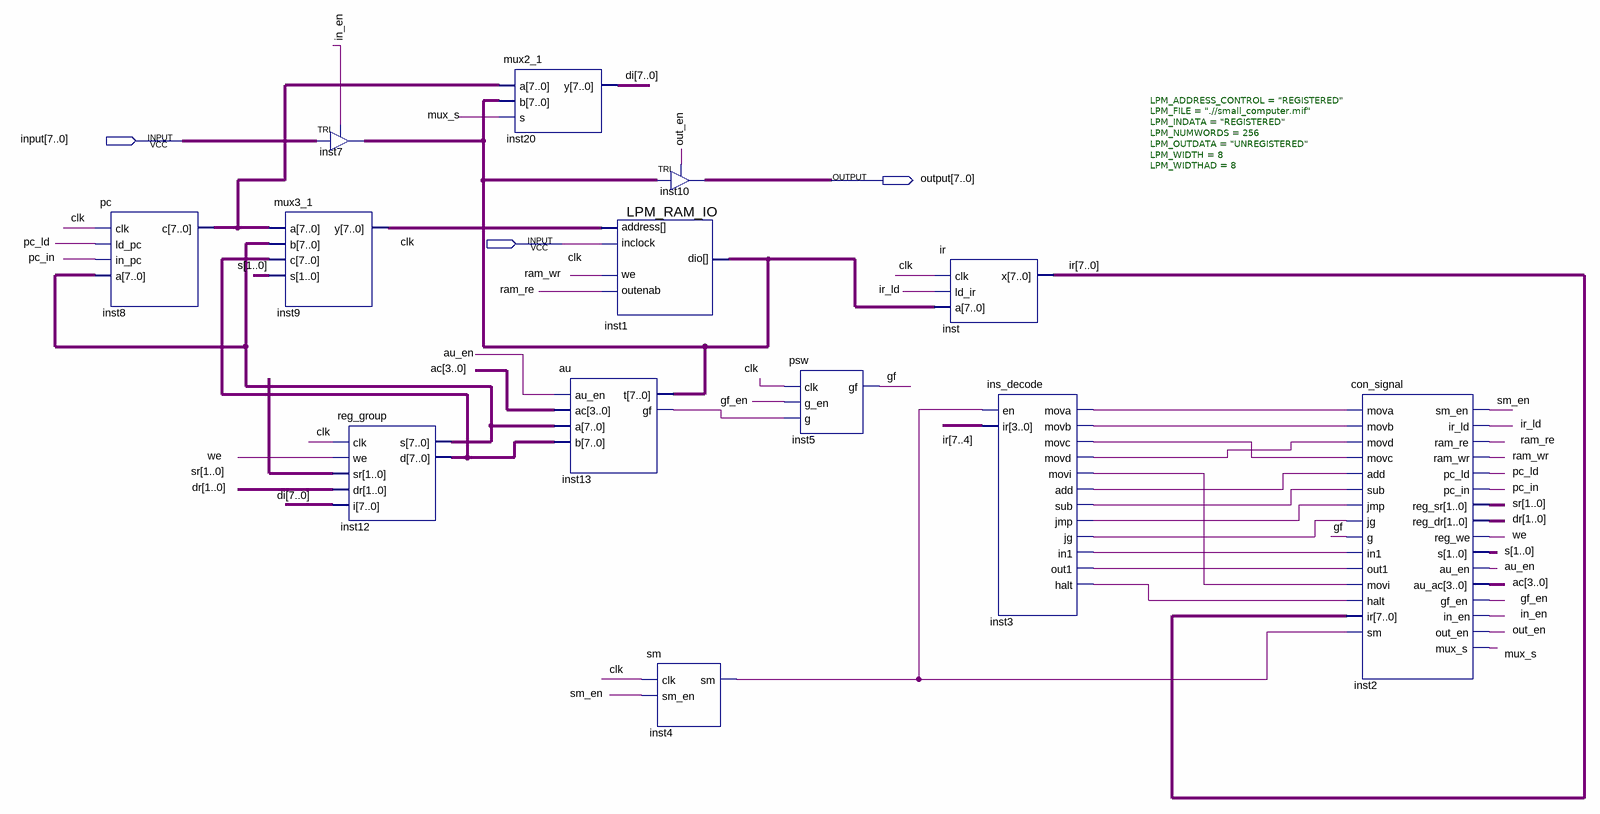
[diagram p0: schematic sheet]
// Quartus schematic small_computer.bdf as structural Verilog: 13 symbols, 3 pins
module small_computer (
  input  [7:0] \input ,
  input  clk,
  output [7:0] \output 
);

  wire au_en, gf, gf_en, in_en, inst3_add, inst3_halt, inst3_in1, inst3_jg, inst3_jmp, inst3_mova,
       inst3_movb, inst3_movc, inst3_movd, inst3_movi, inst3_out1, inst3_sub, inst4_sm, inst13_gf, ir_ld,
       mux_s, out_en, pc_in, pc_ld, ram_re, ram_wr, sm_en, we;
  wire [1:0] dr, s, sr;
  wire [3:0] ac;
  wire [7:0] di, inst7_out, inst8_c, inst9_y, inst12_d, inst12_s, ir;

  pc inst8 (.clk(clk), .ld_pc(pc_ld), .in_pc(pc_in), .a(inst12_s), .c(inst8_c));
  mux3_1 inst9 (.a(inst8_c), .b(inst12_s), .c(inst12_d), .s(s), .y(inst9_y));
  TRI inst7[7:0] (.IN(\input ), .OE(in_en), .OUT(inst7_out));
  reg_group inst12 (.clk(clk), .we(we), .sr(sr), .dr(dr), .i(di), .s(inst12_s), .d(inst12_d));
  mux2_1 inst20 (.a(inst8_c), .b(inst7_out), .s(mux_s), .y(di));
  LPM_RAM_IO #(.LPM_ADDRESS_CONTROL("REGISTERED"), .LPM_FILE(".//small_computer.mif"), .LPM_INDATA("REGISTERED"), .LPM_NUMWORDS(256), .LPM_OUTDATA("UNREGISTERED"), .LPM_WIDTH(8), .LPM_WIDTHAD(8)) inst1 (
    .address(inst9_y), .inclock(clk), .we(ram_wr), .outenab(ram_re), .dio(inst7_out));
  au inst13 (.au_en(au_en), .ac(ac), .a(inst12_s), .b(inst12_d), .t(inst7_out), .gf(inst13_gf));
  TRI inst10[7:0] (.IN(inst7_out), .OE(out_en), .OUT(\output ));
  sm inst4 (.clk(clk), .sm_en(sm_en), .sm(inst4_sm));
  psw inst5 (.clk(clk), .g_en(gf_en), .g(inst13_gf), .gf(gf));
  ir inst (.clk(clk), .ld_ir(ir_ld), .a(inst7_out), .x(ir));
  ins_decode inst3 (
    .en(inst4_sm), .ir(ir[7:4]), .mova(inst3_mova), .movb(inst3_movb), .movc(inst3_movc), .movd(inst3_movd),
    .movi(inst3_movi), .add(inst3_add), .sub(inst3_sub), .jmp(inst3_jmp), .jg(inst3_jg), .in1(inst3_in1),
    .out1(inst3_out1), .halt(inst3_halt));
  con_signal inst2 (
    .mova(inst3_mova), .movb(inst3_movb), .movd(inst3_movd), .movc(inst3_movc), .add(inst3_add),
    .sub(inst3_sub), .jmp(inst3_jmp), .jg(inst3_jg), .g(gf), .in1(inst3_in1), .out1(inst3_out1),
    .movi(inst3_movi), .halt(inst3_halt), .ir(ir), .sm(inst4_sm), .sm_en(sm_en), .ir_ld(ir_ld),
    .ram_re(ram_re), .ram_wr(ram_wr), .pc_ld(pc_ld), .pc_in(pc_in), .reg_sr(sr), .reg_dr(dr), .reg_we(we),
    .s(s), .au_en(au_en), .au_ac(ac), .gf_en(gf_en), .in_en(in_en), .out_en(out_en), .mux_s(mux_s));
endmodule
